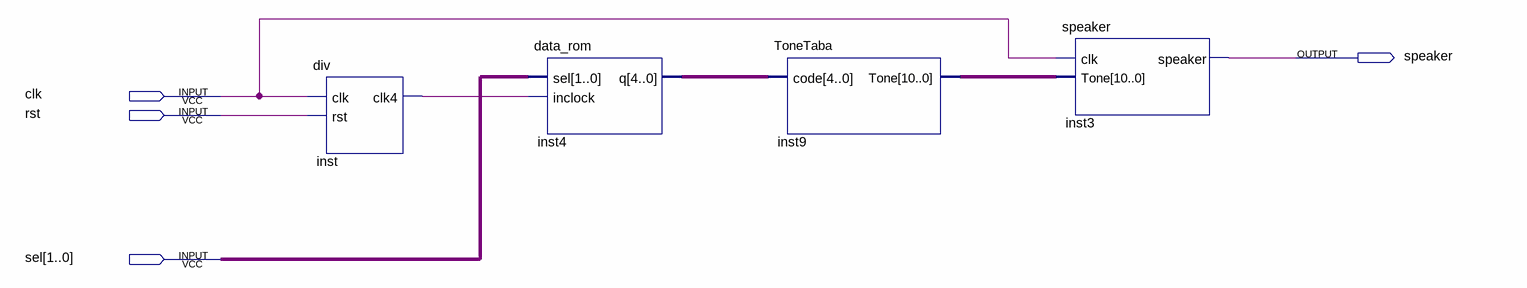
[diagram p0: schematic sheet]
// Quartus schematic music.bdf as structural Verilog: 4 symbols, 4 pins
module music (
  input  clk,
  input  rst,
  input  [1:0] sel,
  output speaker
);

  wire inst_clk4;
  wire [4:0] inst4_q;
  wire [10:0] inst9_tone;

  div inst (.clk(clk), .rst(rst), .clk4(inst_clk4));
  data_rom inst4 (.sel(sel), .inclock(inst_clk4), .q(inst4_q));
  ToneTaba inst9 (.code(inst4_q), .Tone(inst9_tone));
  speaker inst3 (.clk(clk), .Tone(inst9_tone), .speaker(speaker));
endmodule
